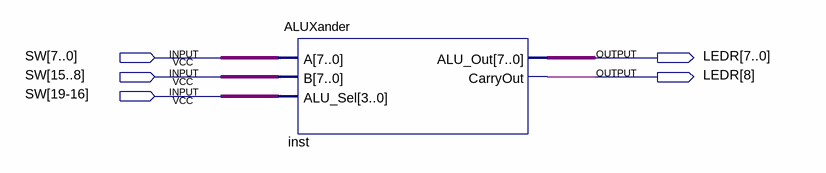
[diagram p0: schematic sheet]
// Quartus schematic ALUXanderTest.bdf as structural Verilog: 1 symbols, 5 pins
module ALUXanderTest (
  input  [15:0] SW,
  input  \SW[19-16] ,
  output [8:0] LEDR
);

  wire [3:0] undriven;

  ALUXander inst (.A(SW[7:0]), .B(SW[15:8]), .ALU_Sel(undriven), .ALU_Out(LEDR[7:0]), .CarryOut(LEDR[8]));
endmodule
